# Altium schematic sheet Etapas_Parte2.SchDoc
size A4
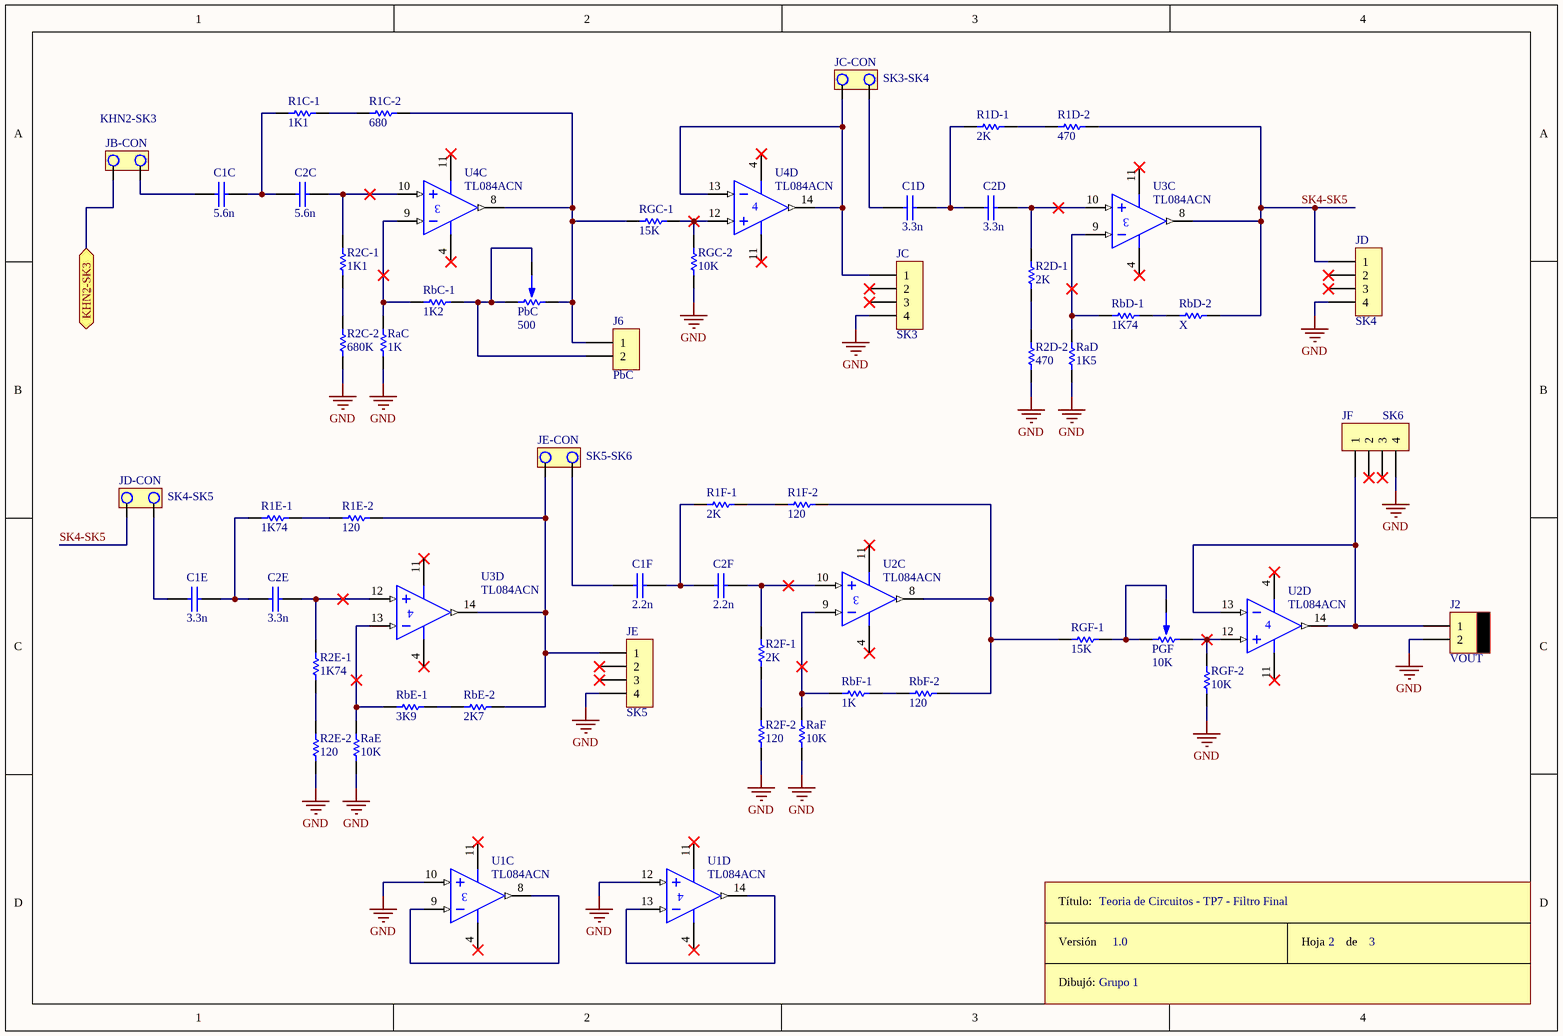
[diagram p0: Etapas_Parte2.SchDoc]

## Parts
C1C  5.6n  [CAP200]
C1D  3.3n  [CAP200]
C1E  3.3n  [CAP200]
C1F  2.2n  [CAP200]
C2C  5.6n  [CAP200]
C2D  3.3n  [CAP200]
C2E  3.3n  [CAP200]
C2F  2.2n  [CAP200]
J2  VOUT  [MOLEX2]
J6  PbC  [SIP2]
JB-CON  KHN2-SK3  [JUMPER2]
JC  SK3  [SIP4]
JC-CON  SK3-SK4  [JUMPER2]
JD  SK4  [SIP4]
JD-CON  SK4-SK5  [JUMPER2]
JE  SK5  [SIP4]
JE-CON  SK5-SK6  [JUMPER2]
JF  SK6  [SIP4]
PbC  500  [PRESET V]
PGF  10K  [PRESET V]
R1C-1  1K1  [RES400]
R1C-2  680  [RES400]
R1D-1  2K  [RES400]
R1D-2  470  [RES400]
R1E-1  1K74  [RES400]
R1E-2  120  [RES400]
R1F-1  2K  [RES400]
R1F-2  120  [RES400]
R2C-1  1K1  [RES400]
R2C-2  680K  [RES400]
R2D-1  2K  [RES400]
R2D-2  470  [RES400]
R2E-1  1K74  [RES400]
R2E-2  120  [RES400]
R2F-1  2K  [RES400]
R2F-2  120  [RES400]
RaC  1K  [RES400]
RaD  1K5  [RES400]
RaE  10K  [RES400]
RaF  10K  [RES400]
RbC-1  1K2  [RES400]
RbD-1  1K74  [RES400]
RbD-2  X  [RES400]
RbE-1  3K9  [RES400]
RbE-2  2K7  [RES400]
RbF-1  1K  [RES400]
RbF-2  120  [RES400]
RGC-1  15K  [RES400]
RGC-2  10K  [RES400]
RGF-1  15K  [RES400]
RGF-2  10K  [RES400]
ROT2  Rótulo  (value not drawn)
U1  TL084ACN  [646-06]  (parts C,D of 4)
U2  TL084ACN  [646-06]  (parts C,D of 4)
U3  TL084ACN  [646-06]  (parts C,D of 4)
U4  TL084ACN  [646-06]  (parts C,D of 4)

## Ports
KHN2-SK3

## Nets
GND: J2.2 JC.4 JD.4 JE.4 JF.4 R2C-2.1 R2D-2.1 R2E-2.1 R2F-2.1 RaC.1 RaD.1 RaE.1 RaF.1 RGC-2.1 RGF-2.1 U1.10(IN+) U1.12(IN+)
KHN2-SK3: JB-CON.2 ; port KHN2-SK3
SK4-SK5: JD.1 JD-CON.2 R1D-2.2 RbD-2.2 U3.8(OUT)
NetC1C_1: C1C.1 JB-CON.1
NetC1C_2: C1C.2 C2C.1 R1C-1.1
NetC1D_1: C1D.1 JC-CON.1
NetC1D_2: C1D.2 C2D.1 R1D-1.1
NetC1E_1: C1E.1 JD-CON.1
NetC1E_2: C1E.2 C2E.1 R1E-1.1
NetC1F_1: C1F.1 JE-CON.1
NetC1F_2: C1F.2 C2F.1 R1F-1.1
NetC2C_2: C2C.2 R2C-1.2 U4.10(IN+)
NetC2D_2: C2D.2 R2D-1.2 U3.10(IN+)
NetC2E_2: C2E.2 R2E-1.2 U3.12(IN+)
NetC2F_2: C2F.2 R2F-1.2 U2.10(IN+)
NetJ2_1: J2.1 JF.1 U2.13(IN-) U2.14(OUT)
NetJ6_1: J6.1 PbC.3 R1C-2.2 RGC-1.1 U4.8(OUT)
NetJ6_2: J6.2 PbC.1 PbC.2 RbC-1.1
NetJC_1: JC.1 JC-CON.2 U4.13(IN-) U4.14(OUT)
NetJE_1: JE.1 JE-CON.2 R1E-2.2 RbE-2.2 U3.14(OUT)
NetPGF_1: PGF.1 PGF.2 RGF-1.1
NetPGF_3: PGF.3 RGF-2.2 U2.12(IN+)
NetR1C-1_2: R1C-1.2 R1C-2.1
NetR1D-1_2: R1D-1.2 R1D-2.1
NetR1E-1_2: R1E-1.2 R1E-2.1
NetR1F-1_2: R1F-1.2 R1F-2.1
NetR1F-2_2: R1F-2.2 RbF-2.2 RGF-1.2 U2.8(OUT)
NetR2C-1_1: R2C-1.1 R2C-2.2
NetR2D-1_1: R2D-1.1 R2D-2.2
NetR2E-1_1: R2E-1.1 R2E-2.2
NetR2F-1_1: R2F-1.1 R2F-2.2
NetRaC_2: RaC.2 RbC-1.2 U4.9(IN-)
NetRaD_2: RaD.2 RbD-1.2 U3.9(IN-)
NetRaE_2: RaE.2 RbE-1.2 U3.13(IN-)
NetRaF_2: RaF.2 RbF-1.2 U2.9(IN-)
NetRbD-1_1: RbD-1.1 RbD-2.1
NetRbE-1_1: RbE-1.1 RbE-2.1
NetRbF-1_1: RbF-1.1 RbF-2.1
NetRGC-1_2: RGC-1.2 RGC-2.2 U4.12(IN+)
NetU1_8: U1.8(OUT) U1.9(IN-)
NetU1_13: U1.13(IN-) U1.14(OUT)

Not connected (* = marked no-connect by the designer): JC 2* 3*; JD 2* 3*; JE 2* 3*; JF 2* 3*; U1 4(V+)* 11(V-)*; U2 4(V+)* 11(V-)*; U3 4(V+)* 11(V-)*; U4 4(V+)* 11(V-)*

## Notes on the sheet
- Teoria de Circuitos - TP7 - Filtro Final
- Grupo 1
- 1.0
- 2
- 3
- (in symbol Rótulo) Título:; Versión; Hoja       de; Dibujó:

## Library data of the parts
C1C C1D C1E C1F C2C C2D C2E C2F = CAP
J2 = MOLEX2
J6 = CON2
JB-CON JC-CON JD-CON JE-CON = JUMPER
JC JD JE JF = CON4
PbC PGF = PRESET
R1C-1 R1C-2 R1D-1 R1D-2 R1E-1 R1E-2 R1F-1 R1F-2 R2C-1 R2C-2 R2D-1 R2D-2 R2E-1 R2E-2 R2F-1 R2F-2 RaC RaD RaE RaF RbC-1 RbD-1 RbD-2 RbE-1 RbE-2 RbF-1 RbF-2 RGC-1 RGC-2 RGF-1 RGF-2 = RES
U1-U4 = TL084ACN: JFET-Input Operational Amplifier; Published: 17-Jul-2002; LatestRevisionDate: 06-Jun-2005; LatestRevisionNote: Stylized 3D Model Added.; DatasheetVersion: 1988; PackageVersion: 1997; PackageReference: 646-06; Publisher: Altium Limited; PackageDescription: DIP; 14 Leads; Row Spacing 7.62 mm; Pitch 2.54 mm; ComponentLink1Description: Manufacturer Link; ComponentLink1URL: http://www.onsemi.com/site/products/parametrics/0,4446,251,00.html